# Altium schematic sheet RasPiHAT-INPUT.SchDoc
size 409 x 282 mm; >DRAWING_NAME: RasPi-BplusHAT.sch; >LAST_DATE_TIME: 08-Jan-17 10:29:30 AM; >SHEET: 1; Sheet:: Sheet:
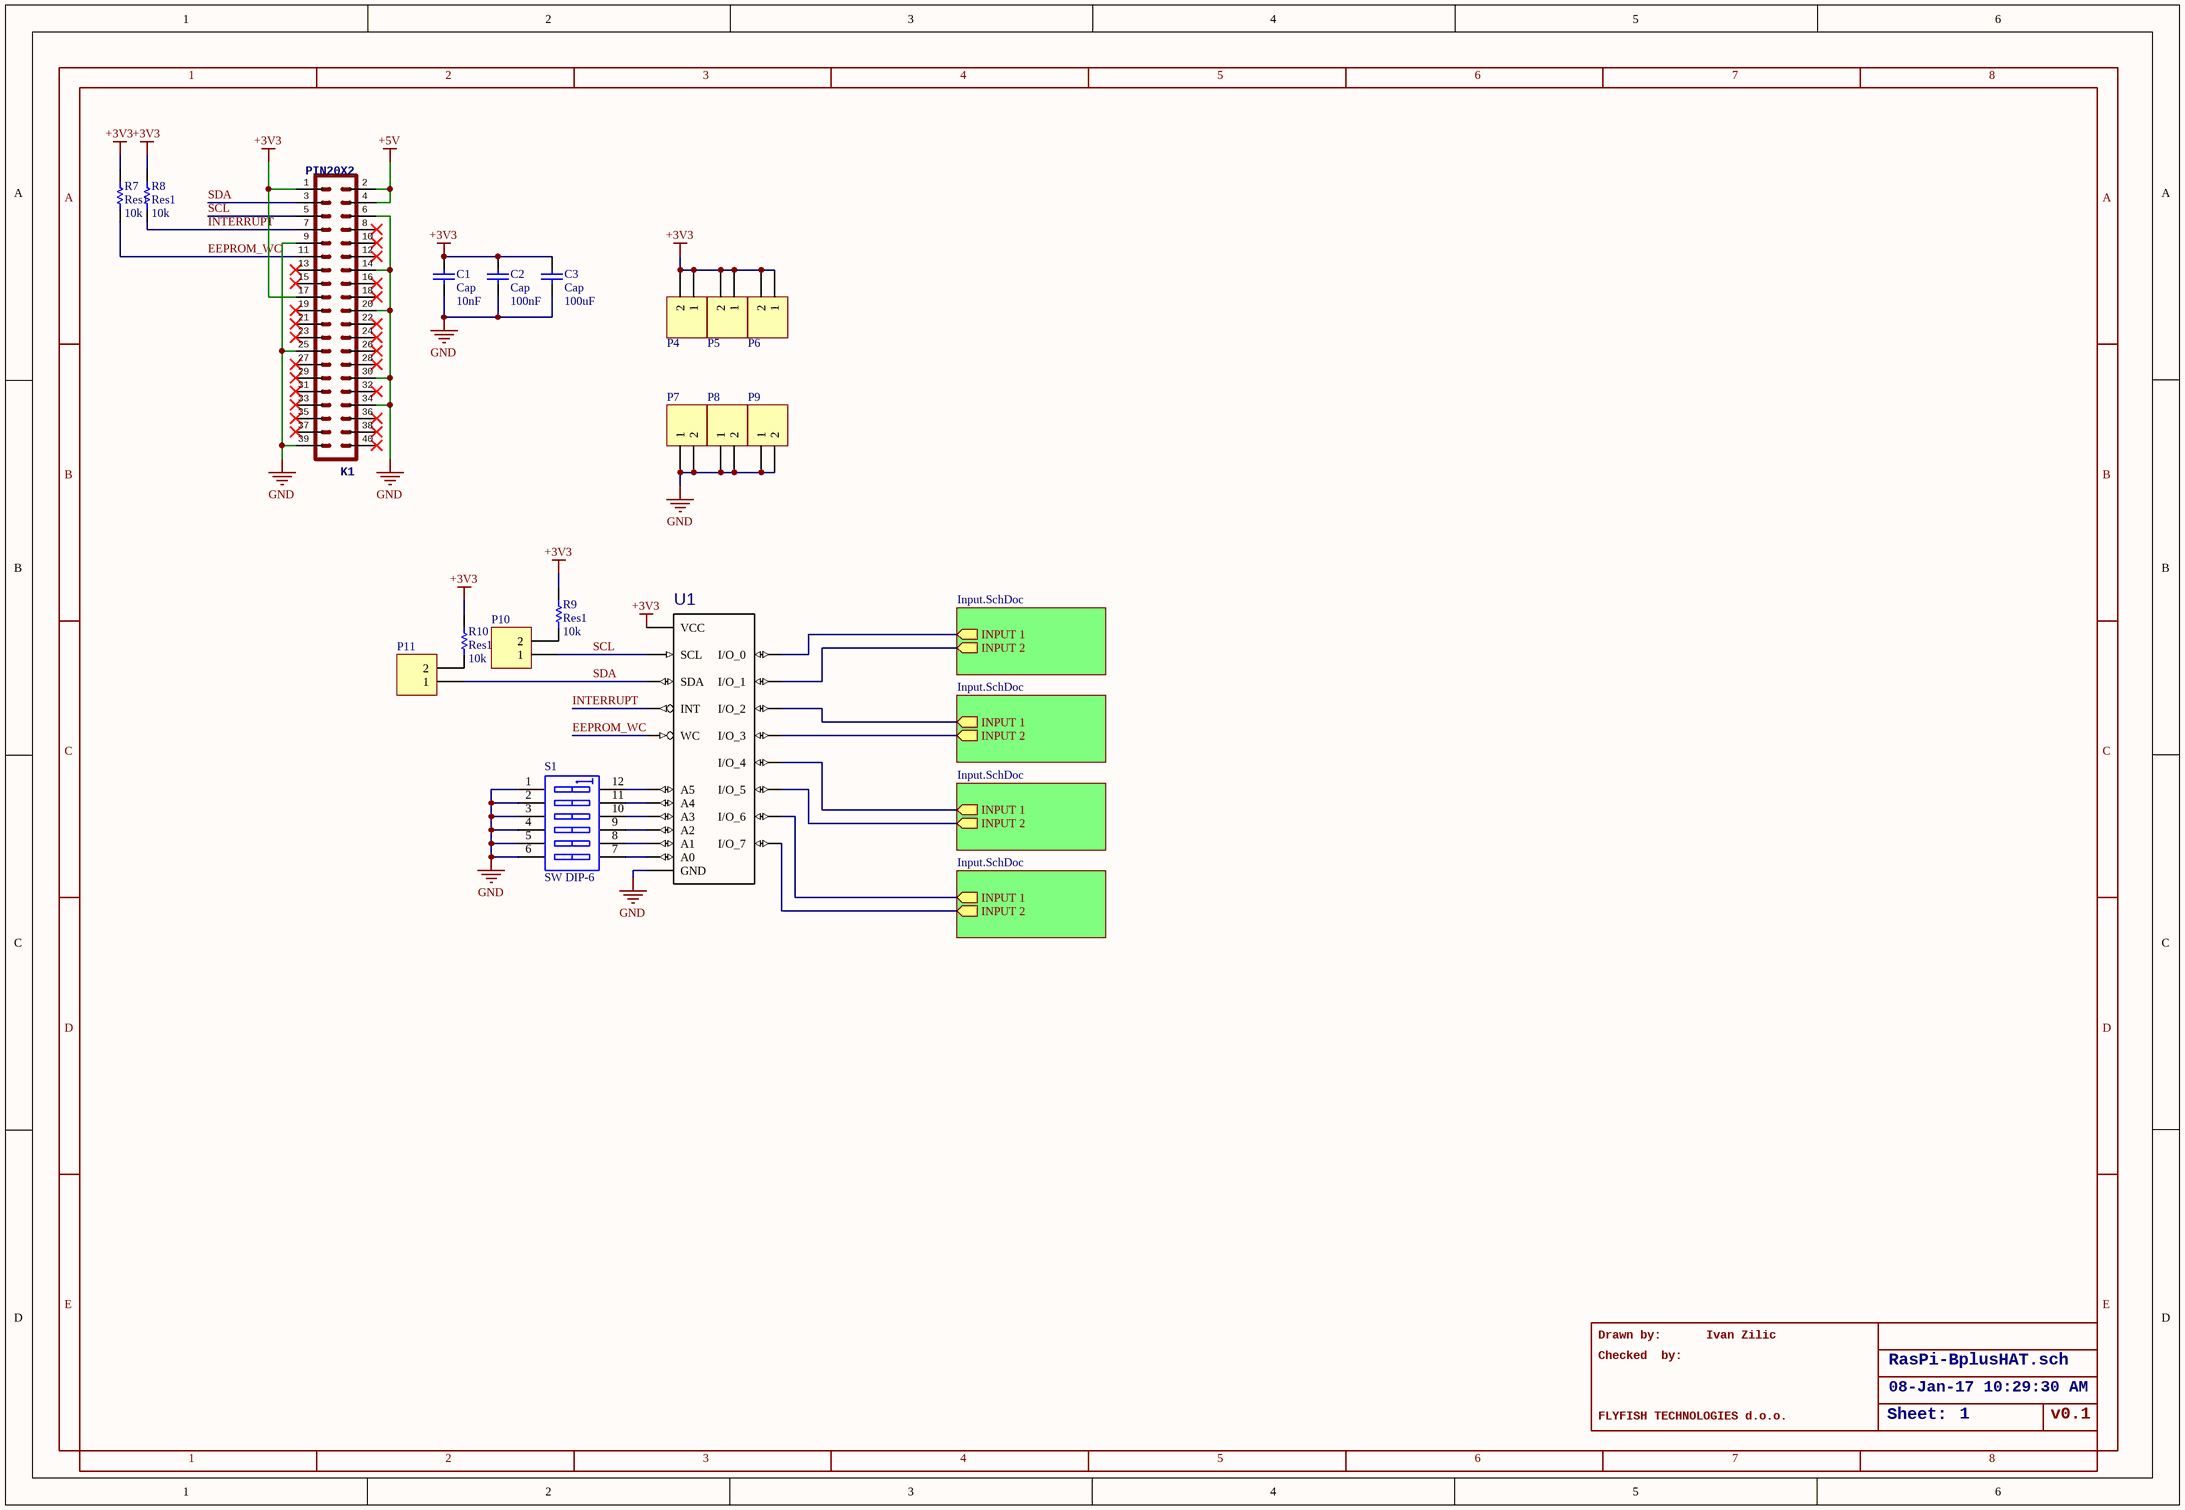
[diagram p0: RasPiHAT-INPUT.SchDoc]

## Parts
C1  Cap  value 10nF  [6-0805_N]
C2  Cap  value 100nF  [6-0805_N]
C3  Cap  value 100uF  [6-0805_N]
K1  >NAME: K1  [HDR2X20]  (hidden comment: PIN20X2)
P4  Header 2  [2 PIN TERM BLK]  (value not drawn)
P5  Header 2  [2 PIN TERM BLK]  (value not drawn)
P6  Header 2  [2 PIN TERM BLK]  (value not drawn)
P7  Header 2  [2 PIN TERM BLK]  (value not drawn)
P8  Header 2  [2 PIN TERM BLK]  (value not drawn)
P9  Header 2  [2 PIN TERM BLK]  (value not drawn)
P10  Header 2  [HDR1X2]  (value not drawn)
P11  Header 2  [HDR1X2]  (value not drawn)
R7  Res1  value 10k  [6-0805_N]
R8  Res1  value 10k  [6-0805_N]
R9  Res1  value 10k  [6-0805_N]
R10  Res1  value 10k  [6-0805_N]
S1  SW DIP-6  [DIP-12/SW]
U1  PCA9501  [TSSOP20]  (value not drawn)

## Sub-sheets
RM = Input.SchDoc: INPUT 1 (out), INPUT 2 (out)
RM = Input.SchDoc: INPUT 1 (out), INPUT 2 (out)
RM = Input.SchDoc: INPUT 1 (out), INPUT 2 (out)
RM = Input.SchDoc: INPUT 1 (out), INPUT 2 (out)

## Nets
+3V3: C1.2 C2.2 C3.2 K1.1 K1.17 P4.1 P4.2 P5.1 P5.2 P6.1 P6.2 R7.1 R8.1 R9.1 R10.1 U1.20(VCC)
+5V: K1.2 K1.4
GND: C1.1 C2.1 C3.1 K1.6 K1.9 K1.14 K1.20 K1.25 K1.30 K1.34 K1.39 P7.1 P7.2 P8.1 P8.2 P9.1 P9.2 S1.1(A1) S1.2(A2) S1.3(A3) S1.4(A4) S1.5(A5) S1.6(A6) U1.10(GND)
EEPROM_WC: K1.11 R7.2 U1.17(WC)
INTERRUPT: K1.7 R8.2 U1.8(INT)
SCL: K1.5 P10.1 U1.18(SCL)
SDA: K1.3 P11.1 U1.19(SDA)
NetP10_2: P10.2 R9.2
NetP11_2: P11.2 R10.2
NetS1_7: S1.7(B6) U1.1(A0)
NetS1_8: S1.8(B5) U1.2(A1)
NetS1_9: S1.9(B4) U1.3(A2)
NetS1_10: S1.10(B3) U1.12(A3)
NetS1_11: S1.11(B2) U1.11(A4)
NetS1_12: S1.12(B1) U1.9(A5)
NetU1_4: U1.4(I/O_0) ; sheet RM/INPUT 1
NetU1_5: U1.5(I/O_1) ; sheet RM/INPUT 2
NetU1_6: U1.6(I/O_2) ; sheet RM/INPUT 1
NetU1_7: U1.7(I/O_3) ; sheet RM/INPUT 2
NetU1_13: U1.13(I/O_4) ; sheet RM/INPUT 1
NetU1_14: U1.14(I/O_5) ; sheet RM/INPUT 2
NetU1_15: U1.15(I/O_6) ; sheet RM/INPUT 1
NetU1_16: U1.16(I/O_7) ; sheet RM/INPUT 2

Not connected (* = marked no-connect by the designer): K1 8* 10* 12* 13* 15* 16* 18* 19* 21* 22* 23* 24* 26* 27* 28* 29* 31* 32* 33* 35* 36* 37* 38* 40*

## Notes on the sheet
- Drawn by:
- Checked  by:
- Ivan Zilic
- FLYFISH TECHNOLOGIES d.o.o.
- v0.1
- 1
- 2
- 3
- 4
- 5
- 6
- 7
- 8
- A
- B
- C
- D
- E

## Library data of the parts
C1-C3 = Cap: Capacitor; Published: 8-Jun-2000; LatestRevisionDate: 17-Jul-2002; LatestRevisionNote: Re-released for DXP Platform.; PackageReference: RAD-0.3; Publisher: Altium Limited; PackageDescription: Radial Cap, Thru-Hole; 2 Leads; 0.3 in Pin Spacing
P4-P11 = Header 2: Header, 2-Pin; LatestRevisionDate: 17-Jul-2002; LatestRevisionNote: Re-released for DXP Platform.; Publisher: Altium Limited
R7-R10 = Res1: Resistor; Published: 8-Jun-2000; LatestRevisionDate: 17-Jul-2002; LatestRevisionNote: Re-released for DXP Platform.; PackageReference: AXIAL-0.3; Publisher: Altium Limited; PackageDescription: Axial Device, Thru-Hole; 2 Leads; 0.3 in Pin Spacing
S1 = SW DIP-6: DIP Switch, 6 Position, SPST; Published: 24-Mar-1999; LatestRevisionDate: 17-Jul-2002; LatestRevisionNote: Re-released for DXP Platform.; PackageReference: DIP-12/SW; Publisher: Altium Limited; PackageDescription: DIP Switch; 12 Leads
U1 = PCA9501: MF: NXP Semiconductors; MP: PCA9501; Package: None; Availability: Unavailable; Price: None; Value: *
K1 = PIN20X2: >VALUE: PIN20X2